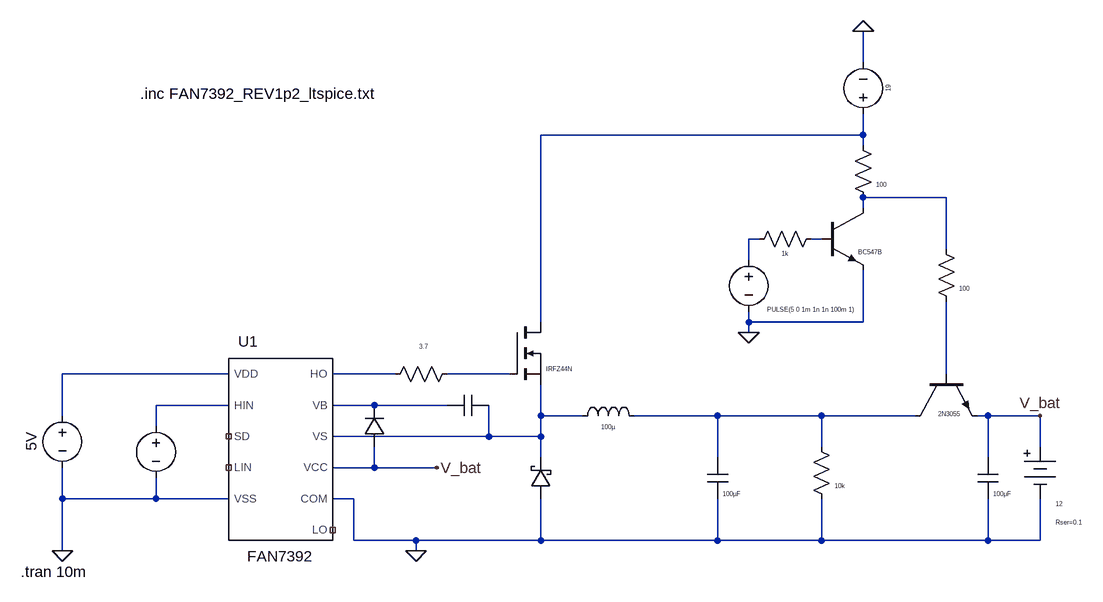
[diagram p0: schematic Isolated battery.asc]
Isolated battery.asc, the LTspice schematic file:
Version 4
SHEET 1 6712 680
WIRE 1104 -432 1104 -480
WIRE 1104 -320 1104 -352
WIRE 1104 -320 608 -320
WIRE 1104 -304 1104 -320
WIRE 1232 -224 1104 -224
WIRE 1104 -208 1104 -224
WIRE 944 -160 928 -160
WIRE 1040 -160 1024 -160
WIRE 1232 -144 1232 -224
WIRE 928 -128 928 -160
WIRE 608 -32 608 -320
WIRE 928 -32 928 -48
WIRE 1104 -32 1104 -112
WIRE 1104 -32 928 -32
WIRE 928 -16 928 -32
WIRE 128 48 -128 48
WIRE 384 48 288 48
WIRE 560 48 464 48
WIRE 1232 48 1232 -64
WIRE 128 96 16 96
WIRE 352 96 288 96
WIRE 464 96 352 96
WIRE -128 112 -128 48
WIRE 608 112 608 64
WIRE 672 112 608 112
WIRE 880 112 752 112
WIRE 1040 112 880 112
WIRE 1184 112 1040 112
WIRE 1296 112 1280 112
WIRE 1376 112 1296 112
WIRE 16 128 16 96
WIRE 528 144 528 96
WIRE 528 144 288 144
WIRE 608 144 608 112
WIRE 608 144 528 144
WIRE 1040 160 1040 112
WIRE 1376 160 1376 112
WIRE 608 176 608 144
WIRE 880 176 880 112
WIRE 1296 176 1296 112
WIRE 352 192 352 160
WIRE 352 192 288 192
WIRE 448 192 352 192
WIRE -128 240 -128 192
WIRE 16 240 16 208
WIRE 16 240 -128 240
WIRE 128 240 16 240
WIRE 320 240 288 240
WIRE 320 304 320 240
WIRE 416 304 320 304
WIRE 608 304 608 240
WIRE 608 304 416 304
WIRE 880 304 880 240
WIRE 880 304 608 304
WIRE 1040 304 1040 240
WIRE 1040 304 880 304
WIRE 1296 304 1296 240
WIRE 1296 304 1040 304
WIRE 1376 304 1376 240
WIRE 1376 304 1296 304
WIRE -128 320 -128 240
WIRE 416 320 416 304
FLAG 416 320 0
FLAG 1104 -480 0
FLAG -128 320 0
FLAG 928 -16 0
FLAG 448 192 V_bat
FLAG 1376 112 V_bat
SYMBOL Gate\ drivers\\FAN7392 208 160 R0
SYMATTR InstName U1
SYMBOL nmos 560 -32 R0
WINDOW 0 56 32 Invisible 2
WINDOW 3 56 72 Left 0
SYMATTR InstName M1
SYMATTR Value IRFZ44N
SYMBOL res 480 32 R90
WINDOW 0 0 56 Invisible 2
WINDOW 3 -33 52 VTop 0
SYMATTR InstName R1
SYMATTR Value 3.7
SYMBOL ind 656 128 R270
WINDOW 0 32 56 Invisible 2
WINDOW 3 5 56 VBottom 0
SYMATTR InstName L1
SYMATTR Value 100µ
SYMBOL cap 528 80 R90
WINDOW 0 0 32 Invisible 2
WINDOW 3 32 32 Invisible 2
SYMATTR InstName C1
SYMATTR Value 1µF
SYMBOL voltage 1104 -336 R180
WINDOW 0 32 56 Invisible 2
WINDOW 3 -32 56 VBottom 0
WINDOW 123 0 0 Left 0
WINDOW 39 0 0 Left 0
SYMATTR InstName V2
SYMATTR Value 19
SYMBOL voltage -128 96 R0
WINDOW 0 32 56 Invisible 2
WINDOW 3 -32 56 VBottom 2
WINDOW 123 0 0 Left 0
WINDOW 39 0 0 Left 0
SYMATTR InstName V3
SYMATTR Value 5V
SYMBOL voltage 16 112 R0
WINDOW 0 24 16 Invisible 2
WINDOW 3 24 96 Invisible 2
WINDOW 123 0 0 Left 0
WINDOW 39 0 0 Left 0
SYMATTR InstName V4
SYMATTR Value PULSE(0 5v 1n 1n 1n 13.5u 20u)
SYMBOL cap 864 176 R0
WINDOW 0 24 8 Invisible 2
WINDOW 3 24 56 Left 0
SYMATTR InstName C2
SYMATTR Value 100µF
SYMBOL diode 368 160 R180
WINDOW 0 24 64 Invisible 2
WINDOW 3 24 0 Invisible 2
SYMATTR InstName D1
SYMATTR Value 1N4148
SYMBOL schottky 624 240 R180
WINDOW 0 24 64 Invisible 2
WINDOW 3 24 0 Invisible 2
SYMATTR InstName D2
SYMATTR Value SS3P5
SYMATTR Description Diode
SYMATTR Type diode
SYMBOL Misc\\battery 1376 144 R0
WINDOW 0 24 16 Invisible 2
WINDOW 3 24 104 Left 0
WINDOW 123 0 0 Left 0
WINDOW 39 24 132 Left 0
SYMATTR InstName V1
SYMATTR Value 12
SYMATTR SpiceLine Rser=0.1
SYMBOL res 1024 144 R0
WINDOW 0 36 40 Invisible 2
WINDOW 3 36 76 Left 0
SYMATTR InstName R2
SYMATTR Value 10k
SYMBOL npn 1040 -208 R0
WINDOW 0 56 32 Invisible 2
WINDOW 3 56 68 Left 0
SYMATTR InstName Q1
SYMATTR Value BC547B
SYMBOL voltage 928 -144 R0
WINDOW 0 -32 56 Invisible 2
WINDOW 3 96 86 Top 0
WINDOW 123 0 0 Left 0
WINDOW 39 0 0 Left 0
SYMATTR InstName V6
SYMATTR Value PULSE(5 0 1m 1n 1n 100m 1)
SYMBOL res 1088 -320 R0
WINDOW 0 36 40 Invisible 2
WINDOW 3 36 76 Left 0
SYMATTR InstName R3
SYMATTR Value 100
SYMBOL npn 1184 48 M90
WINDOW 0 56 32 Invisible 2
WINDOW 3 61 53 VCenter 0
SYMATTR InstName Q2
SYMATTR Value 2N3055
SYMBOL res 1040 -176 R90
WINDOW 0 0 56 Invisible 2
WINDOW 3 32 56 VTop 0
SYMATTR InstName R4
SYMATTR Value 1k
SYMBOL res 1216 -160 R0
WINDOW 0 36 40 Invisible 2
WINDOW 3 36 76 Left 0
SYMATTR InstName R5
SYMATTR Value 100
SYMBOL cap 1280 176 R0
WINDOW 0 24 8 Invisible 2
WINDOW 3 24 56 Left 0
SYMATTR InstName C3
SYMATTR Value 100µF
TEXT -192 352 Left 2 !.tran 10m
TEXT -8 -384 Left 2 !.inc FAN7392_REV1p2_ltspice.txt

The netlist it stands for:
* Isolated battery.asc
XU1 V_bat 0 N009 NC_01 N005 N010 N011 N006 0 NC_02 NC_03 FAN7392  ; pins VCC COM HIN LIN VDD VB VS HO VSS SD LO
M1 N001 N007 N011 N011 IRFZ44N
R1 N007 N006 3.7
L1 N011 N012 100µ
C1 N011 N010 1µF
V2 N001 0 19
V3 N005 0 5V
V4 N009 0 PULSE(0 5v 1n 1n 1n 13.5u 20u)
C2 N012 0 100µF
D1 V_bat N010 1N4148
D2 0 N011 SS3P5
V1 V_bat 0 12 Rser=0.1
R2 N012 0 10k
Q1 N002 N004 0 0 BC547B
V6 N003 0 PULSE(5 0 1m 1n 1n 100m 1)
R3 N001 N002 100
Q2 N012 N008 V_bat 0 2N3055
R4 N004 N003 1k
R5 N002 N008 100
C3 V_bat 0 100µF
.model D D
.lib standard.dio
.model NPN NPN
.model PNP PNP
.lib standard.bjt
.model NMOS NMOS
.model PMOS PMOS
.lib standard.mos
.tran 10m
.inc FAN7392_REV1p2_ltspice.txt
.backanno
.end